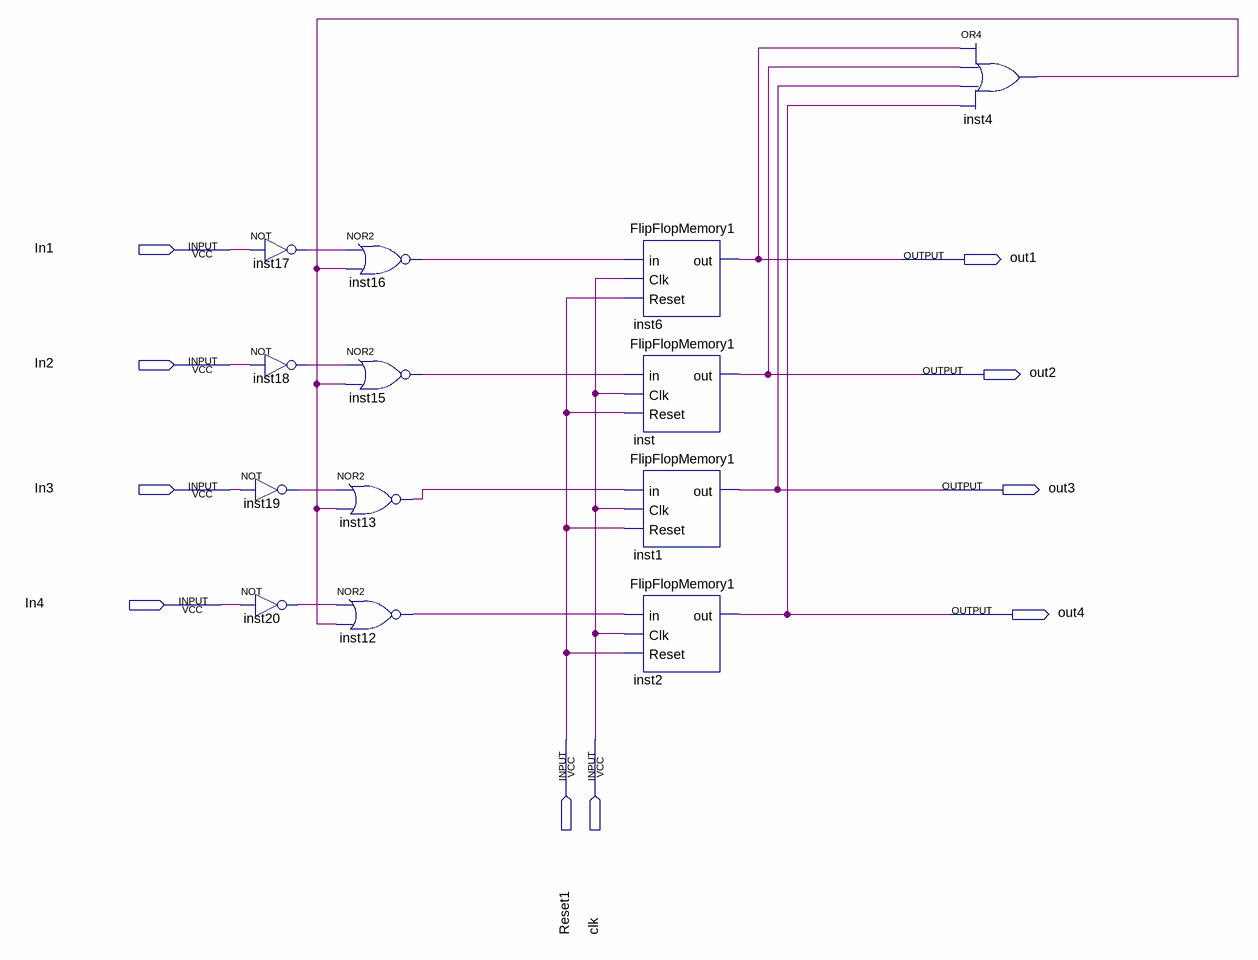
[diagram p0: schematic sheet]
// Quartus schematic FourFPPSOneUse.bdf as structural Verilog: 13 symbols, 10 pins
module FourFPPSOneUse (
  input  In1,
  input  In2,
  input  In3,
  input  In4,
  input  Reset1,
  input  clk,
  output out1,
  output out2,
  output out3,
  output out4
);

  wire inst4_out, inst12_out, inst13_out, inst15_out, inst16_out, inst17_out, inst18_out, inst19_out,
       inst20_out;

  not inst19 (inst19_out, In3);
  not inst20 (inst20_out, In4);
  not inst17 (inst17_out, In1);
  not inst18 (inst18_out, In2);
  nor inst16 (inst16_out, inst17_out, inst4_out);
  nor inst15 (inst15_out, inst18_out, inst4_out);
  nor inst13 (inst13_out, inst19_out, inst4_out);
  nor inst12 (inst12_out, inst20_out, inst4_out);
  FlipFlopMemory1 inst6 (.in(inst16_out), .Clk(clk), .Reset(Reset1), .out(out1));
  FlipFlopMemory1 inst (.in(inst15_out), .Clk(clk), .Reset(Reset1), .out(out2));
  FlipFlopMemory1 inst1 (.in(inst13_out), .Clk(clk), .Reset(Reset1), .out(out3));
  FlipFlopMemory1 inst2 (.in(inst12_out), .Clk(clk), .Reset(Reset1), .out(out4));
  or inst4 (inst4_out, out1, out2, out3, out4);
endmodule
